# EasyEDA Pro project ProDoc_SMD test 2_2025-04-19.epro, board PCB1_3
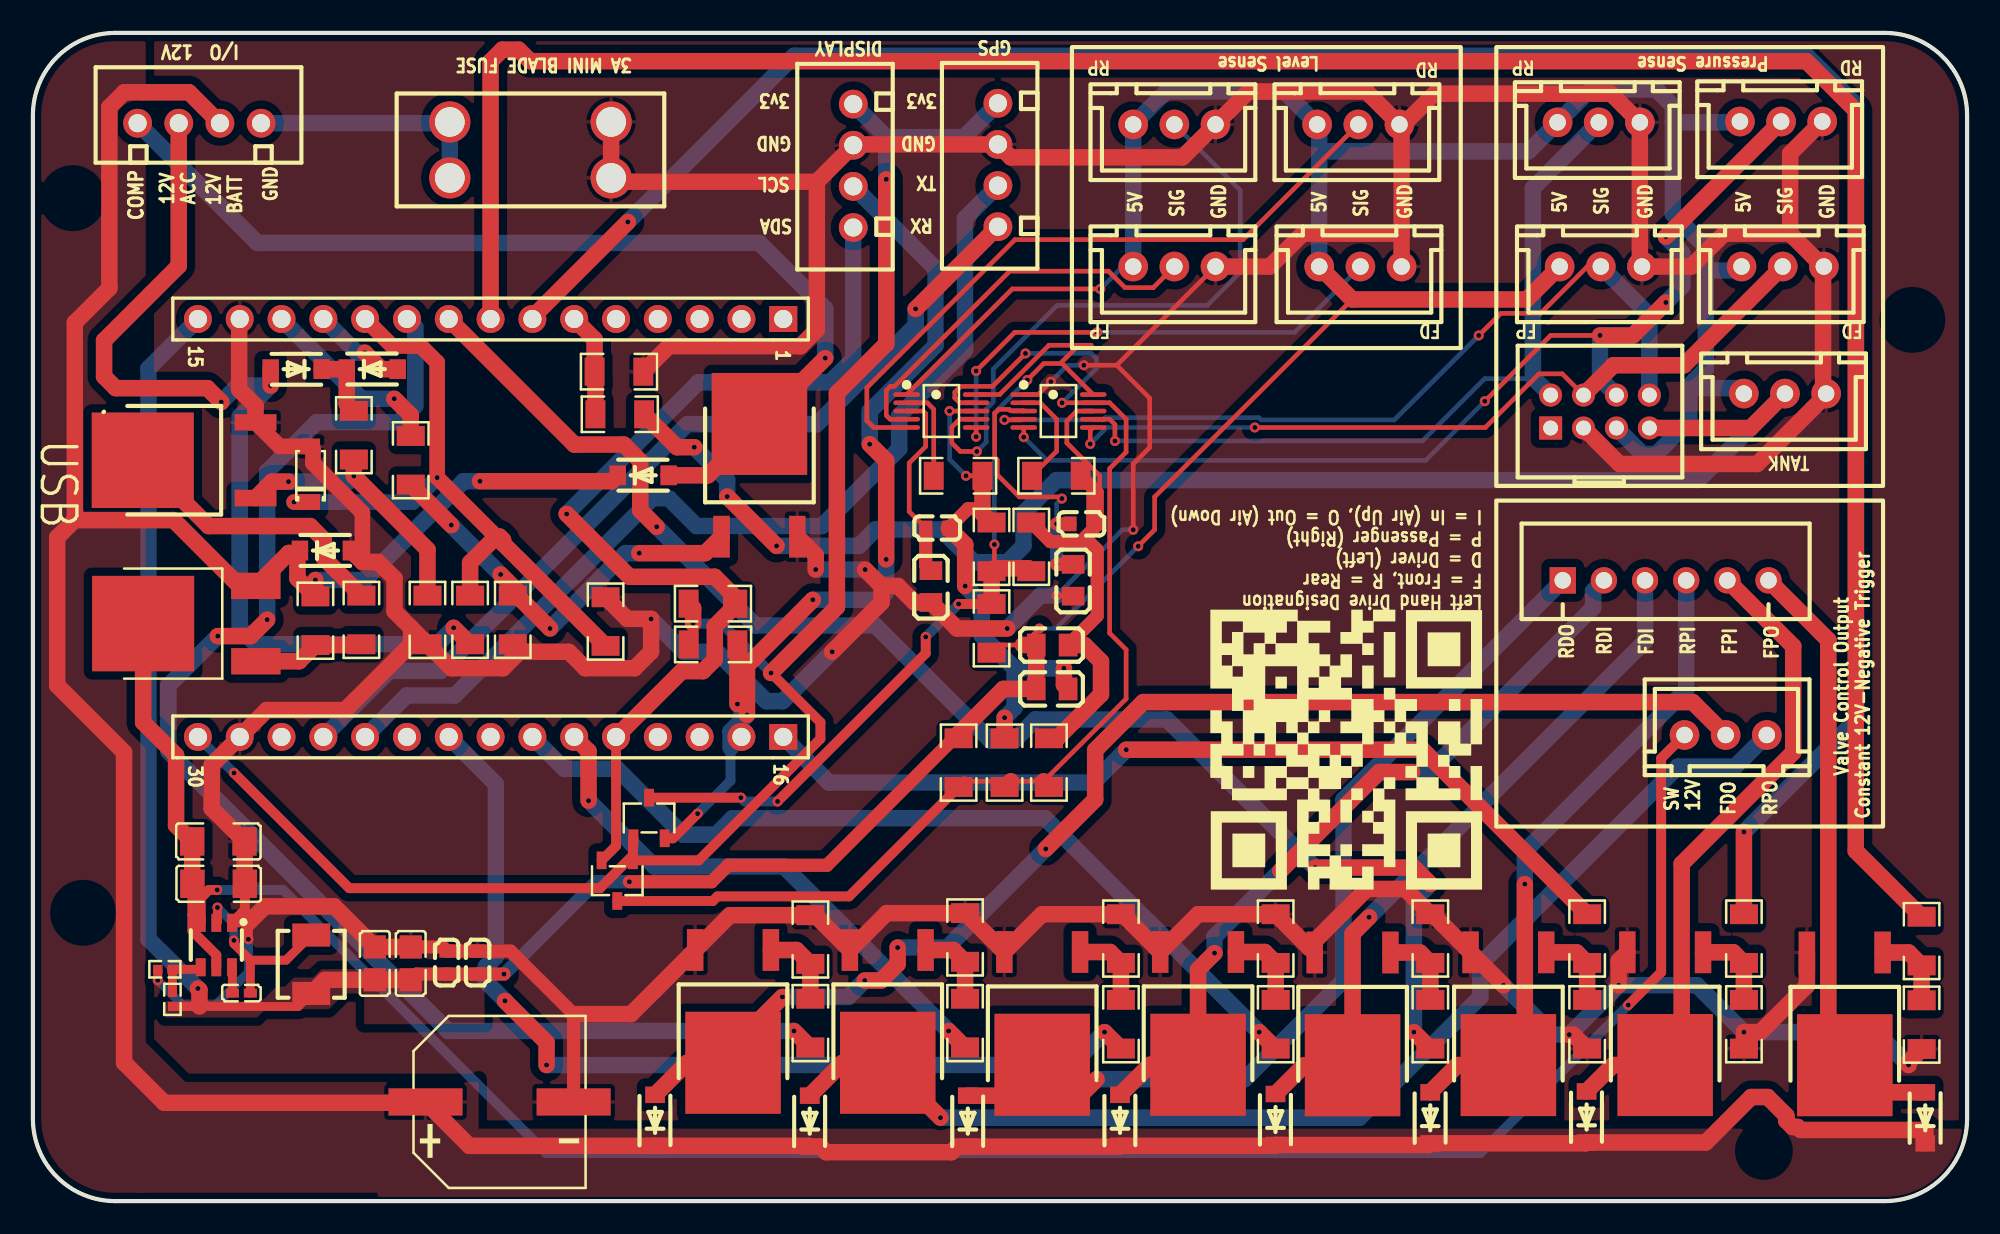
[diagram p1: board, top side]
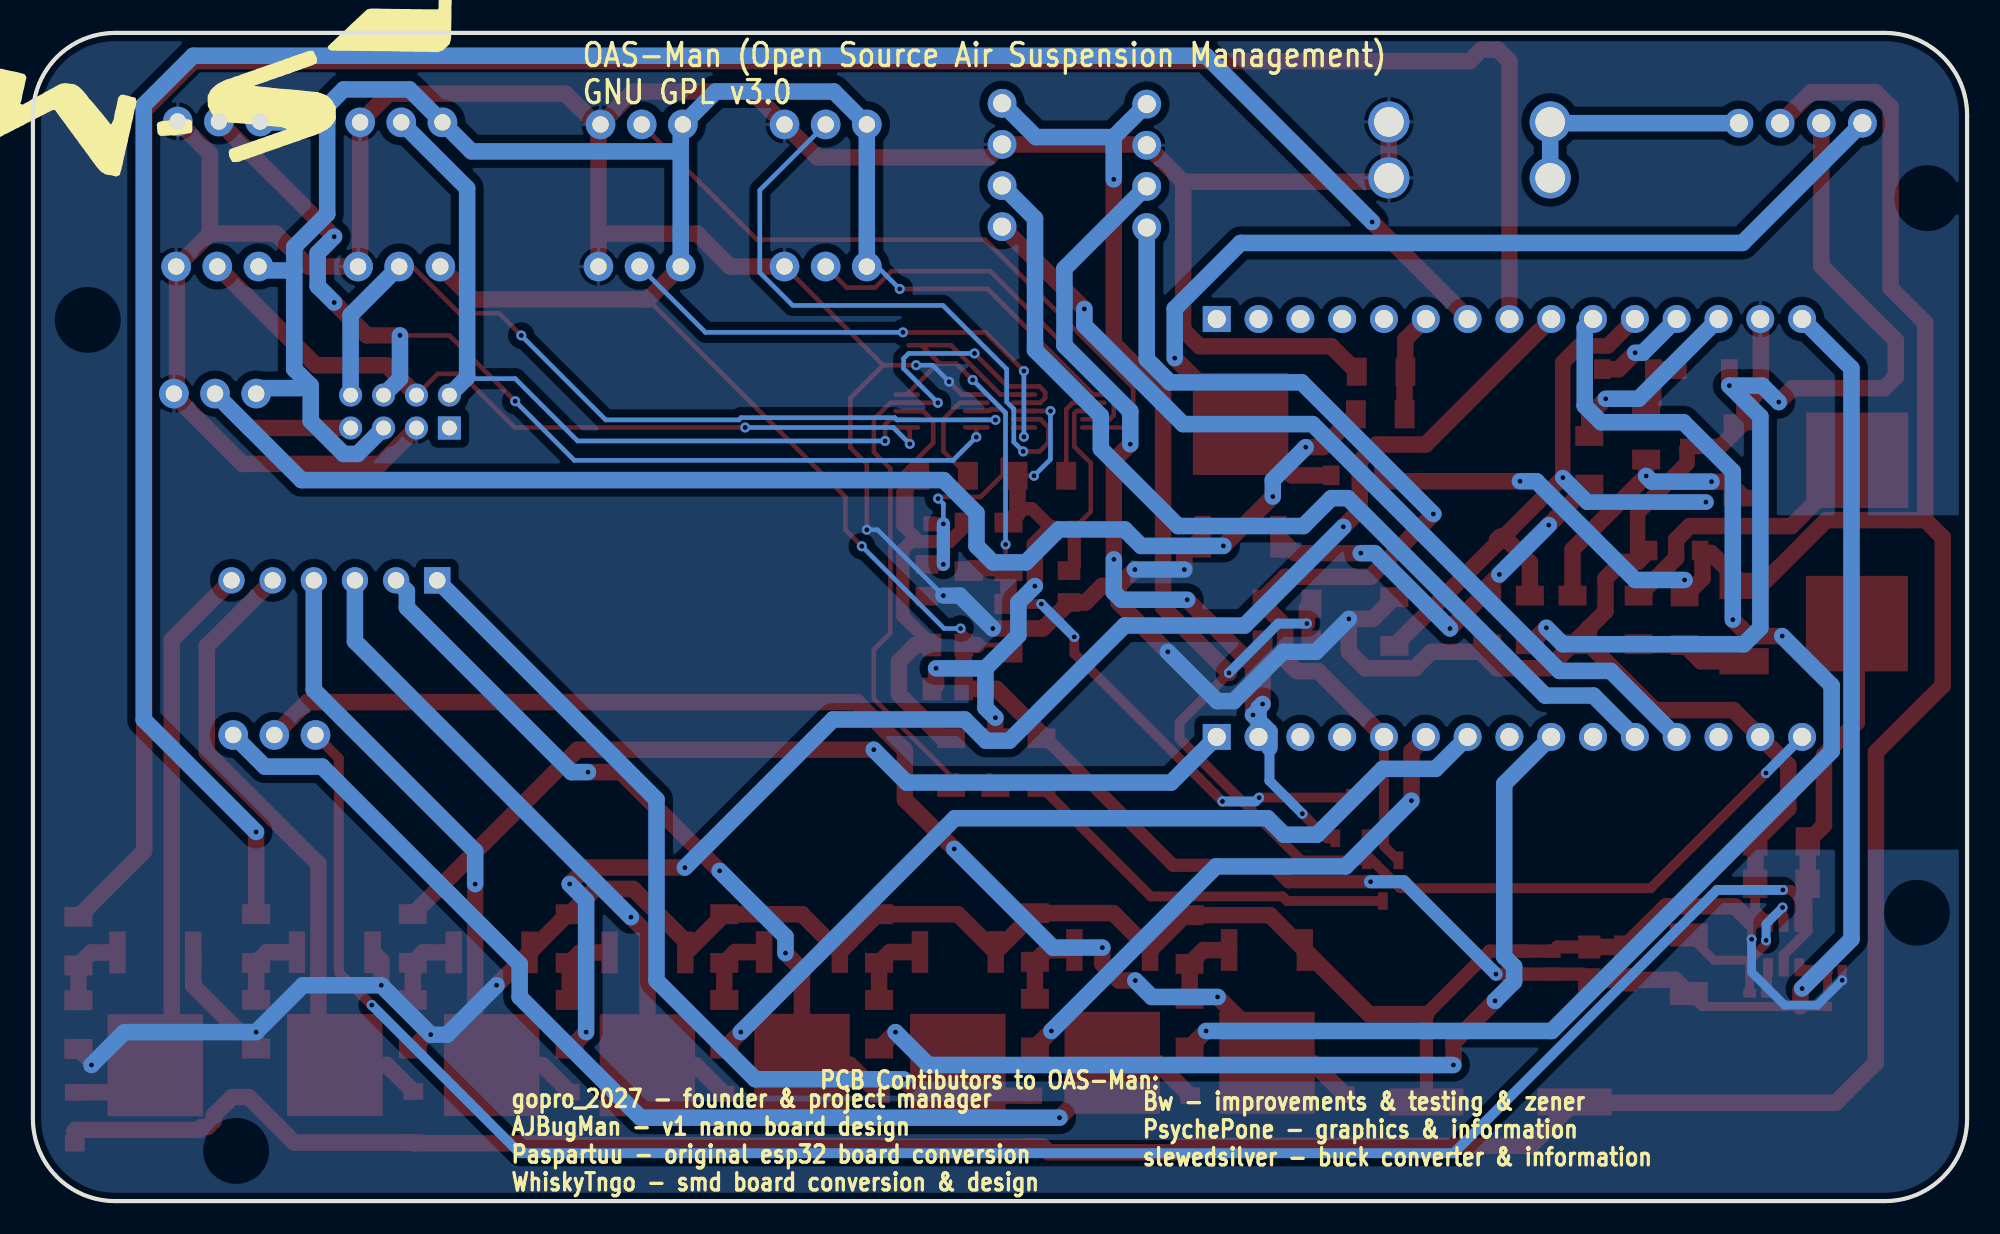
[diagram p2: board, bottom side, seen from below]

Outline 117.5 x 71 mm; copper layers: Top Layer, Bottom Layer. Coordinates in mm from the lower left corner of the outline.
Outline path: 0,66 0,5 arc(1.46,1.46) 5,0 112.5,0 arc(116.04,1.46) 117.5,5 117.5,66 arc(116.04,69.54) 112.5,71 5,71 arc(1.46,69.54) 0,66
Stack: Top Layer 0.035mm / Dielectric1 1.51mm FR4 er 4.5 / Bottom Layer 0.035mm

## Design rules (mm)
template: Custom Config
spacing copperThickness1oz: track to track 0.102, other pairs 0.152 to 0.3
spacing copperThickness2oz (default): track to track 0.203, other pairs 0.152 to 0.3
track width copperThickness1oz (default): min 0.127, default 1, max 2.54
track width copperThickness2oz: min 0.203, default 0.254, max 2.54
differential pair differentialPair (default): width min 0.127, default 0.254, max 2.54; gap min 0.152, default 0.152
via viaSize (default): diameter min 0.5, default 0.61, max 10; hole min 0.3, default 0.305, max 6.3
net $1N33547 uses Fullfill
pour e143 uses Fullfill
pour e746 uses Fullfill
pour e1012 uses Fullfill

## Placement (name value [footprint] x y rotation side)
C1  1uF  [C0603]  54.93 40.91 180 top
C2  1uF  [C0603]  63.7 41.16 180 top
C5  1uF  [C0603]  25.14 14.5 270 top
C6  1uF  [C0603]  27.02 14.5 270 top
C12  100nF  [C0402]  12.67 12.64 0 top
C13  22uF  [C0805]  22.95 14.44 270 top
C14  22uF  [C0805]  20.77 14.44 270 top
C15  10uF  [C1206]  11.27 21.86 180 top
C16  10uF  [C1206]  11.28 19.28 180 top
C17  1000uF  [CAP-SMD_BD10.0-L10.3-W10.3-FD]  28.35 6.03 0 top
CN1  XH-4A绿色  [CONN-TH_XH-4A-1]  10.11 65.51 180 top
D1  SM4007PL  [SOD-123F_L2.8-W1.8-LS3.7-RD]  94.39 5.11 90 top
D2  SM4007PL  [SOD-123F_L2.8-W1.8-LS3.7-RD]  114.96 5.06 90 top
D3  SM4007PL  [SOD-123F_L2.8-W1.8-LS3.7-RD]  75.49 4.96 90 top
D4  SM4007PL  [SOD-123F_L2.8-W1.8-LS3.7-RD]  37.8 4.91 90 top
D5  SM4007PL  [SOD-123F_L2.8-W1.8-LS3.7-RD]  56.79 4.86 90 top
D6  SM4007PL  [SOD-123F_L2.8-W1.8-LS3.7-RD]  66.04 4.91 90 top
D7  SM4007PL  [SOD-123F_L2.8-W1.8-LS3.7-RD]  47.19 4.86 90 top
D8  SM4007PL  [SOD-123F_L2.8-W1.8-LS3.7-RD]  84.89 5.06 90 top
D9  SM4007PL  [SOD-123F_L2.8-W1.8-LS3.7-RD]  37.07 44.11 0 top
D10  SM4007PL  [SOD-123F_L2.8-W1.8-LS3.7-RD]  17.77 39.54 0 top
D15  SM4007PL  [SOD-123F_L2.8-W1.8-LS3.7-RD]  15.99 50.56 180 top
D16  SM4007PL  [SOD-123F_L2.8-W1.8-LS3.7-RD]  20.61 50.56 0 top
F2  XF-508P-B-B  [FUSE-TH_4P-L16.0-W6.7]  30.23 63.89 0 top
FD_LEVEL2  XH-3A  [CONN-TH_XH-3A]  80.65 56.8 180 top
FD_PRESS1  XH-3A  [CONN-TH_XH-3A]  106.3 56.8 180 top
FP_LEVEL2  XH-3A  [CONN-TH_XH-3A]  69.34 56.8 180 top
FP_PRESS1  XH-3A  [CONN-TH_XH-3A]  95.25 56.8 180 top
GPS  XH-4A绿色  [CONN-TH_XH-4A-1]  58.62 62.97 270 top
L3  3.3uH  [IND-SMD_L4.5-W4.1_SL0420]  16.91 14.39 270 top
OLED1  XH-4A绿色  [CONN-TH_XH-4A-1]  49.84 62.92 270 top
Q1  MDT30N06L  [TO-252-2_L6.6-W5.6-P4.60-LS9.7-BR]  99.16 11.7 90 top
Q2  MDT30N06L  [TO-252-2_L6.6-W5.6-P4.60-LS9.7-BR]  110.07 11.68 90 top
Q3  MDT30N06L  [TO-252-2_L6.6-W5.6-P4.60-LS9.7-BR]  80.17 11.68 90 top
Q4  MDT30N06L  [TO-252-2_L6.6-W5.6-P4.60-LS9.7-BR]  42.53 11.83 90 top
Q5  MDT30N06L  [TO-252-2_L6.6-W5.6-P4.60-LS9.7-BR]  61.31 11.71 90 top
Q6  MDT30N06L  [TO-252-2_L6.6-W5.6-P4.60-LS9.7-BR]  70.78 11.71 90 top
Q7  MDT30N06L  [TO-252-2_L6.6-W5.6-P4.60-LS9.7-BR]  51.93 11.83 90 top
Q8  MDT30N06L  [TO-252-2_L6.6-W5.6-P4.60-LS9.7-BR]  89.63 11.69 90 top
Q9  MDT30N06L  [TO-252-2_L6.6-W5.6-P4.60-LS9.7-BR]  44.14 43.81 270 top
Q12  BSS138  [SOT-23-3_L2.9-W1.6-P1.90-LS2.8-BR]  35.5 19.47 90 top
Q13  BSS138  [SOT-23-3_L2.9-W1.6-P1.90-LS2.8-BR]  37.43 23.28 270 top
Q14  MDT30N06L  [TO-252-2_L6.6-W5.6-P4.60-LS9.7-BR]  10.1 45.03 0 top
Q15  MDT35P10D  [TO-252-2_L6.6-W6.1-P4.57-LS9.9-BR-CW]  10.12 35.1 0 top
R1  10kΩ  [R1206]  103.94 10.75 270 top
R2  10kΩ  [R1206]  114.74 10.72 270 top
R3  10kΩ  [R1206]  84.89 15.96 90 top
R4  10kΩ  [R1206]  47.23 15.9 90 top
R5  10kΩ  [R1206]  66.1 15.96 90 top
R6  10kΩ  [R1206]  75.5 15.96 90 top
R7  10kΩ  [R1206]  56.63 16.02 90 top
R8  10kΩ  [R1206]  94.42 10.75 270 top
R9  150Ω  [R1206]  103.94 15.96 90 top
R10  150Ω  [R1206]  114.74 15.8 90 top
R11  150Ω  [R1206]  84.89 10.75 270 top
R12  150Ω  [R1206]  47.23 10.82 270 top
R13  150Ω  [R1206]  66.1 10.75 270 top
R14  150Ω  [R1206]  75.5 10.75 270 top
R15  150Ω  [R1206]  56.63 10.82 270 top
R16  150Ω  [R1206]  94.42 15.96 90 top
R17  150Ω  [R1206]  22.95 45.03 90 top
R18  10kΩ  [R1206]  29.15 35.32 270 top
R19  1kΩ  [R1206]  35.65 47.82 0 top
R23  10kΩ  [R1206]  26.56 35.32 270 top
R24  2kΩ  [R1206]  35.6 50.41 180 top
R25  10kΩ  [R1206]  34.79 35.22 270 top
R27  10kΩ  [R1206]  56.24 26.65 270 top
R28  10kΩ  [R1206]  41.32 33.83 180 top
R29  10kΩ  [R1206]  58.24 34.81 270 top
R30  10kΩ  [R1206]  41.31 36.31 180 top
R33  1MΩ  [R1206]  58.24 39.76 270 top
R37  10kΩ  [R1206]  23.97 35.32 270 top
R38  150Ω  [R1206]  19.5 46.55 90 top
R39  10kΩ  [R1206]  17.16 35.27 270 top
R40  3kΩ  [R1206]  19.95 35.32 270 top
R41  1MΩ  [R1206]  56.2 44.08 180 top
R42  1MΩ  [R1206]  59.03 26.65 270 top
R43  1MΩ  [R1206]  62.17 44.08 180 top
R44  1MΩ  [R1206]  61.72 26.65 90 top
R45  1MΩ  [R1206]  60.65 39.76 90 top
R50  56.2kΩ  [R0402]  8.47 12.26 270 top
R51  10kΩ  [R0402]  8.02 14.09 0 top
RD_LEVEL2  XH-3A  [CONN-TH_XH-3A]  80.52 65.44 180 top
RD_PRESS1  XH-3A  [CONN-TH_XH-3A]  106.2 65.61 180 top
RP_LEVEL2  XH-3A  [CONN-TH_XH-3A]  69.34 65.44 180 top
RP_PRESS1  XH-3A  [CONN-TH_XH-3A]  95.12 65.56 180 top
TANK1  XH-3A  [CONN-TH_XH-3A]  106.44 49.08 180 top
U4  ADS1115IDGSR  [MSOP-10_L3.0-W3.0-P0.50-LS5.0-BL]  55.19 48.02 270 top
U5  ADS1115IDGSR  [MSOP-10_L3.0-W3.0-P0.50-LS5.0-BL]  62.3 48.02 270 top
U7  PM2.54-1*15  [HDR-TH_15P-P2.54-V-F]  27.8 53.61 180 top
U8  PM2.54-1*15  [HDR-TH_15P-P2.54-V-F]  27.8 28.21 180 top
U9  GZ2012D152TF  [L0805]  61.92 31.13 0 top
U10  GZ2012D152TF  [L0805]  54.55 37.35 90 top
U11  GZ2012D152TF  [L0805]  61.92 33.8 0 top
U12  GZ2012D152TF  [L0805]  63.19 37.73 90 top
U13  TPS563200DDCR  [SOT-23-6_L2.9-W1.6-P0.95-LS2.8-BR]  11.14 15.56 90 top
U14  PHB2.0-02-8PZZ  [CONN-TH_8P-P2.00_XUNPU_PHB2.0-02-8PZZ]  95.2 47.99 0 top
VTA1  XH-3A  [CONN-TH_XH-3A]  102.83 28.33 0 top
VTB1  XH-6A  [CONN-TH_6P-P2.50_XH-6A]  99.15 37.73 180 top
ZD1  MMSZ4684  [SOD-123_L2.8-W1.8-LS3.7-RD]  16.87 44.18 90 top

## Footprints (pads in the part's own frame, mm; a bottom-side part is the same pattern mirrored in y, then rotated)
C0402
  rect 0.79x0.54 smd: 1(-0.545,0) 2(0.545,0)
C0603
  rect 0.8x0.9 smd: 1(-0.7,0) 2(0.7,0)
C0805
  rect 1.41x1.35 smd: 1(-1,0) 2(1,0)
C1206
  rect 1.485x1.728 smd: 1(-1.593,0) 2(1.593,0)
CAP-SMD_BD10.0-L10.3-W10.3-FD
  rect 4.5x1.65 smd: 1(-4.5,0) 2(4.5,0)
CONN-TH_6P-P2.50_XH-6A
  rect 1.6x1.6 hole 1: 1(6.213,0)
  round 1.6 hole 1: 2(3.713,0) 3(1.214,0) 4(-1.286,0) 5(-3.787,0) 6(-6.287,0)
CONN-TH_8P-P2.00_XUNPU_PHB2.0-02-8PZZ
  rect 1.4x1.4 hole 0.9: 1(-3,-1)
  round 1.4 hole 0.9: 2(-3,1) 3(-1,-1) 4(-1,1) 5(1,-1) 6(1,1) 7(3,-1) 8(3,1)
CONN-TH_XH-3A
  round 1.8 hole 1: 1(-2.5,0) 2(0,0) 3(2.5,0)
CONN-TH_XH-4A-1
  round 1.75 hole 1.1: 1(-3.75,0) 2(-1.25,0) 3(1.25,0) 4(3.75,0)
FUSE-TH_4P-L16.0-W6.7
  round 2.5 hole 1.8: 1(-4.9,1.7) 2(4.9,1.7) 3(4.9,-1.7) 4(-4.9,-1.7)
HDR-TH_15P-P2.54-V-F
  rect 1.7x1.575 hole 1.1: 1(-17.78,0)
  round 1.7 hole 1.1: 2(-15.24,0) 3(-12.7,0) 4(-10.16,0) 5(-7.62,0) 6(-5.08,0) 7(-2.54,0) 8(0,0) 9(2.54,0) 10(5.08,0) 11(7.62,0) 12(10.16,0) 13(12.7,0) 14(15.24,0) 15(17.78,0)
IND-SMD_L4.5-W4.1_SL0420
  rect 1.4x2.3 smd: 1(-1.775,0) 2(1.775,0)
L0805
  rect 1.133x1.377 smd: 1(-0.966,0) 2(0.966,0)
MSOP-10_L3.0-W3.0-P0.50-LS5.0-BL
  oval 0.28x1.62 smd: 1(-1,-2.11) 2(-0.5,-2.11) 3(0,-2.11) 4(0.5,-2.11) 5(1,-2.11) 6(1,2.11) 7(0.5,2.11) 8(0,2.11) 9(-0.5,2.11) 10(-1,2.11)
R0402
  rect 0.566x0.54 smd: 1(-0.433,0) 2(0.433,0)
R1206
  rect 1.208x1.701 smd: 1(-1.479,0) 2(1.479,0)
SOD-123_L2.8-W1.8-LS3.7-RD
  rect 0.95x1.15 smd: 1(-1.692,0) 2(1.692,0)
SOD-123F_L2.8-W1.8-LS3.7-RD
  rect 1x1.2 smd: 1(-1.55,0) 2(1.55,0)
SOT-23-3_L2.9-W1.6-P1.90-LS2.8-BR
  rect 1.07x0.6 smd: 1(1.235,-0.95) 2(1.235,0.95) 3(-1.235,0)
SOT-23-6_L2.9-W1.6-P0.95-LS2.8-BR
  rect 1.1x0.6 smd: 1(1.35,-0.95) 2(1.35,0) 3(1.35,0.95) 4(-1.35,0.95) 5(-1.35,0) 6(-1.35,-0.95)
TO-252-2_L6.6-W5.6-P4.60-LS9.7-BR
  rect 2.54x1 smd: 1(3.426,-2.3) 3(3.426,2.3)
  rect 6.2x5.8 smd: 2(-3.426,0)
TO-252-2_L6.6-W6.1-P4.57-LS9.9-BR-CW
  rect 3x1.6 smd: 1(3.424,-2.29) 3(3.424,2.29)
  rect 6.2x5.8 smd: 2(-3.424,0)

## Nets
As in the schematic, except:
$1N4374: D2.2 Q2.2 VTB1.6
$1N4463: D1.2 Q1.2 VTB1.5
$1N4464: D8.2 Q8.2 VTB1.4
$1N4465: D3.2 Q3.2 VTB1.3
$1N4466: D6.2 Q6.2 VTB1.2
$1N4467: D5.2 Q5.2 VTB1.1

Pads without a net: U7 1 2 3 4 5; U8 3 4 8 10 13; U14 1

## Via types
v1: diameter 0.61, hole 0.305, Top Layer to Bottom Layer, 114 vias

## Routing (per net, layer and track width the routed paths; a pad name or vN(x,y) marks a point on that pad's centre or on a via; arc(x,y) is an arc through that point)
3.3V: length 106.7
  Top Layer w0.6: 39.84,33.83 40.11,34.1 v1(40.11,35.1) ; v1(12.22,26.02) 19.22,19.02 34.45,19.02 36.45,21.02 ; 36.45,21.02 36.45,22.02 Q13.1 ; 36.45,21.02 Q12.1 40.45,20.71 47.84,28.1 47.84,29.1 v1(44.84,32.1)
  Top Layer w1: v1(51.84,62.1) 51.84,52.1 48.84,49.1 48.84,36.1 v1(44.84,32.1) ; v1(40.11,35.1) 40.11,36.04 R30.2
  Bottom Layer w0.6: v1(12.22,26.02) U8.15 ; v1(44.84,32.1) 41.84,35.1 v1(40.11,35.1)
  Bottom Layer w1: GPS.1 56.57,64.67 51.84,64.67 ; v1(51.84,62.1) 51.84,64.67 ; 51.84,64.67 OLED1.1
12VACC: length 60.2
  Top Layer w1: v1(14.44,49.56) D15.2 ; R23.2 v1(25.56,34.84) ; v1(11.44,48.56) 10.6,49.41 5.03,49.41 4.32,50.12 4.32,52.31 8.86,56.84 CN1.3
  Bottom Layer w1: v1(25.56,34.84) 24.56,33.84 13.56,33.84 12.56,34.84 12.56,47.68 v1(14.44,49.56) 12.44,49.56 v1(11.44,48.56)
12VS: length 140.1
  Top Layer w0.6: VTA1.1 98.92,26.91 98.92,13.91 v1(96.92,11.91) ; U13.5 11.14,14.96 9.69,16.41 9.69,17.41 ; 9.69,17.41 U13.3 10.19,18.41 10.69,18.91 v1(11.19,18.91) ; 9.69,17.41 C16.2
  Top Layer w1: Q15.2 6.7,29.1 8.7,27.1 8.7,22.84 C15.2 9.68,19.3 C16.2
  Bottom Layer w0.6: v1(96.92,11.91) 87.92,2.91 31.19,2.91 15.19,18.91 v1(11.19,18.91)
+5V: length 263.8
  Top Layer w0.28: v1(67.15,39.8) 68.15,40.8 68.15,42.8 80.15,54.8 ; v1(61.15,34.8) 60.15,33.8 58.71,33.8 R29.2 ; U4.1 59.5,55.44 v1(64.84,55.44)
  Top Layer w0.54: R50.2 16.12,11.83 L3.2
  Top Layer w0.8: C13.2 23.3,13.8 C5.2 C6.2 v1(28.62,13.8) ; 56.24,28.41 48.24,20.41 42.24,20.41 41.24,19.41 v1(36.24,19.41)
  Top Layer w1: FD_LEVEL2.3 80.15,54.8 90.75,54.8 FP_PRESS1.3 ; v1(10.02,12.92) 10.12,12.83 10.12,11.83 ; L3.2 17.73,13.44 C14.2 C13.2 ; R27.1 56.24,28.41 58.95,31.13 60.95,31.13 60.95,33.8 60.15,33.8
  Bottom Layer w0.28: 66.84,57.44 v1(64.84,55.44) ; v1(67.15,39.8) 62.15,34.8 v1(61.15,34.8)
  Bottom Layer w0.8: v1(36.24,19.41) 34.24,19.41 v1(28.62,13.8)
  Bottom Layer w1: 100.62,49.41 100.62,49.56 101.62,50.56 101.62,56.56 ; 100.62,49.41 103.6,49.41 TANK1.3 ; 100.62,49.41 100.62,47.41 98.62,45.41 97.78,45.41 U14.5 ; 99.62,65.56 103.65,65.56 RD_PRESS1.3 ; 99.62,65.56 99.62,66.56 98.62,67.56 94.62,67.56 RP_PRESS1.3 90.86,63.8 78.15,63.8 ; 99.62,65.56 99.62,59.99 101.62,57.99 101.62,56.56 ; FD_PRESS1.3 103.56,56.56 101.62,56.56 ; U7.15 7.02,50.61 7.02,15.92 v1(10.02,12.92) ; 78.15,63.8 78.15,65.31 RD_LEVEL2.3 76.02,67.44 68.84,67.44 RP_LEVEL2.3 FP_LEVEL2.3 ; 78.15,63.8 FD_LEVEL2.3
GND: length 466.8
  Top Layer w0.28: 65.84,50.8 67.84,48.8 67.84,45.8 66.84,44.8 v1(66.84,40.8) ; 65.84,50.8 v1(63.84,50.8) ; 65.84,50.8 FP_LEVEL2.1 ; v1(62.19,36.8) 63.15,36.8 U12.1 ; U5.1 61.06,49.02 v1(61.84,49.8)
  Top Layer w0.54: U13.1 13.09,16.91 v1(13.09,15.91) ; v1(7.58,13.42) R51.1
  Top Layer w0.6: C16.1 12.87,17.7 U13.1
  Top Layer w0.8: C17.2 32.85,11.37 29.02,15.2 C6.1 C5.1 24.89,15.44 C13.1
  Top Layer w0.95: Q14.3 14.98,45.87 ZD1.2 17.02,45.72 17.02,44.84 20.02,41.84 20.02,38.84
  Top Layer w1: v1(93.33,10.12) 93.57,10.12 R8.2 ; 13.09,16.91 14.09,17.91 18.3,17.91 C14.1 C13.1 ; 106.75,58.8 108.75,56.8 ; 106.75,58.8 106.75,63.66 RD_PRESS1.1 ; 106.75,58.8 102.75,58.8 100.75,56.8 FP_PRESS1.1 97.62,56.93 RP_PRESS1.1 95.88,67.31 85.15,67.31 83.15,65.31 ; 108.75,56.8 108.75,48.8 ; 108.75,56.8 FD_PRESS1.1 ; Q2.3 107.77,13.1 104.94,10.27 v1(103.94,10.27) R1.2 ; 51.55,37.39 52.55,37.39 53.55,36.39 U10.1 56.14,34.8 v1(59.19,34.8) ; 51.55,37.39 51.55,36.39 v1(48.55,33.39) ; 51.55,37.39 v1(50.55,38.39) ; Q1.3 96.33,14.6 v1(96.33,13.12) ; 47.62,61.95 35.36,61.95 F2.3 F2.2 ; 47.62,61.95 47.62,52.95 46.62,51.95 38.62,51.95 R24.1 ; 47.62,61.95 49.89,64.22 ; 77.5,15.44 81.03,18.97 83.36,18.97 R3.2 85.02,17.44 Q8.3 v1(89.33,13.12) ; 77.5,15.44 77.87,15.11 ; 77.5,15.44 R6.2 70.78,17.44 Q6.3 66.19,17.44 R5.2 61.31,17.44 Q5.3 56.65,17.5 R7.2 51.87,17.5 Q7.3 47.51,17.38 R4.2 42.35,17.38 Q4.3 36.34,11.37 32.85,11.37 ; 29.55,33.39 R18.2 ; 29.55,33.39 32.55,33.39 33.55,32.39 36.55,32.39 37.55,33.39 v1(37.55,35.39) 36.1,35.39 R25.1 ; 29.55,33.39 28.55,32.39 25.43,32.39 R37.2 22.97,34.84 ; Q14.3 13.53,48.33 12.53,49.33 12.53,53.57 U7.14 ; 49.89,64.22 GPS.2 59.41,63.44 69.84,63.44 RP_LEVEL2.1 73.84,67.44 81.02,67.44 RD_LEVEL2.1 83.15,65.31 ; 49.89,64.22 49.89,64.22 OLED1.2 ; v1(113.94,8.27) 113.94,8.45 R2.2 ; 83.15,58.8 83.15,65.31 ; 83.15,58.8 FD_LEVEL2.1 ; 83.15,58.8 77.15,58.8 75.15,56.8 FP_LEVEL2.1 ; 22.97,34.84 21.97,35.84 21.97,37.84 20.97,38.84 20.02,38.84 D10.2 ; 22.97,34.84 22.97,33.84 18.97,29.84 14.2,29.84 U8.14 10.86,26.51 10.86,23.86 C15.1 12.86,19.3 C16.1 ; 108.75,48.8 104.75,44.8 96.39,44.8 U14.3 ; 108.75,48.8 TANK1.1 ; v1(47.55,38.39) 47.55,39.26 Q9.3
  Bottom Layer w0.28: v1(66.84,40.8) 66.19,40.8 v1(62.19,36.8) ; v1(63.84,50.8) 62.84,50.8 v1(61.84,49.8)
  Bottom Layer w0.54: v1(13.09,15.91) 13.09,13.91 11.09,11.91 9.09,11.91 v1(7.58,13.42)
  Bottom Layer w1: v1(59.19,34.8) 61.19,36.8 v1(62.19,36.8) ; v1(48.55,33.39) 45.55,30.39 44.55,30.39 41.55,33.39 39.55,33.39 v1(37.55,35.39) ; v1(89.33,13.12) 92.33,10.12 v1(93.33,10.12) v1(96.33,13.12) 101.09,13.12 v1(103.94,10.27) 111.94,10.27 v1(113.94,8.27) ; v1(50.55,38.39) v1(47.55,38.39)
VCC: length 225.2
  Top Layer w1: 2.53,41.39 8.54,41.39 12.54,37.39 Q15.3 15.54,39.39 16.07,39.39 ; 2.53,41.39 1.48,40.34 1.48,31.34 5.54,27.28 5.54,8.41 7.98,5.98 23.8,5.98 C17.1 26.51,3.36 47.14,3.36 D7.1 47.85,3.31 48.19,2.97 55.79,2.97 56.13,3.31 D5.1 65.99,3.31 66.04,3.36 75.44,3.36 D3.1 84.78,3.41 D8.1 94.34,3.51 D1.1 101.62,3.56 104.39,6.32 105.39,6.32 106.52,5.19 106.52,4.89 106.9,4.5 107.21,4.5 107.39,4.32 114.91,4.32 114.96,4.27 D2.1 ; 2.53,41.39 2.54,41.41 2.54,53.39 4.65,55.49 4.65,66.49 5.54,67.39 9.48,67.39 CN1.2 ; D9.1 35.16,43.75 v1(27.16,43.75) ; 16.07,39.39 16.07,37.84 R39.1 v1(17.16,37.75) ; 16.07,39.39 D10.1
  Bottom Layer w1: v1(27.16,43.75) 26.16,43.75 20.16,37.75 v1(17.16,37.75)
D13: length 11.5
  Top Layer w1: 22.95,46.5 22.95,47.76 v1(21.95,48.76)
  Bottom Layer w1: v1(21.95,48.76) 19.95,48.76 U7.13
D14: length 42.2
  Top Layer w0.95: v1(15.87,42.48) ZD1.1 ; 28.56,39.97 v1(24.56,43.97) 24.56,50.97 23.56,51.97 21.82,51.97 U7.11
  Top Layer w1: R23.1 26.56,38.8 28.14,40.39 28.35,40.39 28.56,40.18 28.56,39.97 R25.2
  Bottom Layer w0.95: v1(15.87,42.48) 23.07,42.48 v1(24.56,43.97)
ESPD12: length 5.8
  Top Layer w1: D16.2 21.17,50.56 v1(20.17,51.56)
  Bottom Layer w1: v1(20.17,51.56) 19.69,51.56 U7.12
RX: length 54.4
  Top Layer w1: GPS.4 v1(53.62,54.22)
  Bottom Layer w1: U8.12 21.66,32.22 24.76,32.22 39.76,47.22 47.62,47.22 53.62,53.22 v1(53.62,54.22)
SCL: length 58.6
  Top Layer w0.6: Q13.2 38.88,22.05 v1(40.38,23.55)
  Top Layer w1: v1(47.38,36.55) 43.38,32.55 v1(43.38,29.55) ; v1(51.84,39) 51.84,45 v1(50.84,46) ; v1(42.8,30.21) R28.1
  Bottom Layer w0.6: U8.2 42.38,27.55 42.38,25.55 v1(40.38,23.55)
  Bottom Layer w1: v1(50.84,46) 50.84,48 54.84,52 54.84,56.67 OLED1.3 ; v1(51.84,39) 51.84,37 51.38,36.55 v1(47.38,36.55) ; 42.38,27.55 42.38,28.55 43.04,29.21 ; v1(42.8,30.21) 43.04,29.97 43.04,29.21 ; 43.04,29.21 v1(43.38,29.55) ; 43.04,29.21 U8.2
SDA: length 62.1
  Top Layer w0.6: Q12.2 35.42,21.58 U8.5
  Top Layer w1: 42.42,35.94 42.42,36.94 41.42,37.94 36.24,37.94 v1(32.42,41.76) ; 42.42,35.94 41.42,34.94 41.42,32.92 40.71,32.21 39.42,32.21 U8.5 ; 42.42,35.94 R30.1
  Bottom Layer w1: OLED1.4 49.84,51.17 48.42,49.76 40.42,49.76 v1(32.42,41.76)
TANKPRESSUESIG: length 89
  Top Layer w1: v1(40.18,45.82) 39.13,45.82 R19.2 ; U14.7 104.34,46.99 TANK1.2 ; v1(45.18,39.82) v1(42.18,42.82)
  Bottom Layer w1: v1(40.18,45.82) 42.18,43.82 v1(42.18,42.82) ; TANK1.2 101.18,43.82 62.18,43.82 60.18,41.82 60.18,39.82 59.18,38.82 57.18,38.82 55.18,40.82 51.18,40.82 50.18,39.82 v1(45.18,39.82)
TX: length 59.6
  Bottom Layer w1: U8.11 22.69,30.72 25.62,30.72 37.62,42.72 38.62,42.72 40.32,41.03 47.93,41.03 52.62,45.72 52.62,47.72 56.62,51.72 56.62,59.72 GPS.3
$1N4350: length 5
  Top Layer w1: R8.1 R16.1 93.78,15.12 Q8.1
$1N4351: length 4.9
  Top Layer w1: R15.1 R7.1 55.91,15.26 Q7.1
$1N4352: length 4.9
  Top Layer w1: R14.1 R6.1 74.83,15.14 Q6.1
$1N4353: length 5
  Top Layer w1: R13.1 R5.1 65.44,15.14 Q5.1
$1N4354: length 4.9
  Top Layer w1: Q4.1 46.39,15.26 47.23,14.42 R12.1
$1N4355: length 4.9
  Top Layer w1: R11.1 R3.1 84.26,15.11 82.47,15.11
$1N4356: length 4.8
  Top Layer w1: R2.1 R10.1 113.95,15.11 Q2.1
$1N4357: length 5
  Top Layer w1: Q1.1 103.3,15.12 R9.1 R1.1
$1N4371: length 78.7
  Top Layer w1: v1(45.53,12.41) 42.53,9.41 Q4.2 39.74,8.41 37.8,6.46 ; v1(61.53,21.41) 64.53,24.41 64.53,27.41 67.45,30.33 100.83,30.33 102.83,28.33 ; v1(50.53,13.41) 51.53,13.41 52.53,14.41 v1(52.53,15.41)
  Bottom Layer w1: v1(61.53,21.41) 55.53,15.41 v1(52.53,15.41) ; v1(45.53,12.41) 49.53,12.41 v1(50.53,13.41)
$1N4374: length 37
  Top Layer w1: D2.2 111.71,6.61 Q2.2 109.07,9.26 109.07,34.09 VTB1.6
$1N4376: length 25.2
  Top Layer w1: Q9.1 40.84,39.38 v1(36.84,39.38) ; v1(28.41,38.09) 29.41,37.09 29.41,36.8 ; v1(25.41,41.09) R17.1 ; v1(31.41,34.8) 29.41,36.8 ; 29.41,36.8 R18.1
  Bottom Layer w1: v1(28.41,38.09) v1(25.41,41.09) ; v1(31.41,34.8) 35.99,39.38 v1(36.84,39.38)
$1N4377: length 151.1
  Top Layer w1: R10.2 110.74,21.28 110.74,66.28 107.74,69.28 30.21,69.28 29.51,69.98 28.51,69.98 27.8,69.27 U7.8
$1N4378: length 87.5
  Top Layer w1: R11.2 v1(83.89,10.27) ; v1(37.89,40.98) 36.89,41.98 36.89,44.98 35.89,45.98 32.89,45.98 U7.9 ; v1(84.89,19.27) 83.89,20.27 v1(77.89,20.27)
  Bottom Layer w1: v1(37.89,40.98) 43.89,34.98 51.18,34.98 58.19,27.98 59.6,27.98 60.89,29.27 68.89,29.27 v1(77.89,20.27) ; v1(84.89,19.27) 83.89,18.27 v1(83.89,10.27)
$1N4379: length 61.9
  Top Layer w1: v1(48.14,51.23) Q9.2 41.01,44.11 D9.2
  Bottom Layer w1: CN1.4 13.64,58.23 44.14,58.23 48.14,54.23 v1(48.14,51.23)
$1N4380: length 59
  Top Layer w1: R13.2 v1(65.1,10.27) ; v1(31.2,8.27) 31.2,9.64 v1(28.68,12.17)
  Bottom Layer w1: v1(31.2,8.27) 63.1,8.27 v1(65.1,10.27) ; U8.9 28.12,25.36 28.12,14.85 27.52,14.25 27.52,13.34 28.68,12.18 v1(28.68,12.17)
$1N4381: length 53.8
  Top Layer w1: R14.2 v1(74.5,10.27)
  Bottom Layer w1: v1(74.5,10.27) 61.5,23.27 42.5,23.27 41.5,22.27 39.5,22.27 35.5,26.27 32.28,26.27 U8.7
$1N4383: length 6.3
  Top Layer w1: 34.17,47.82 34.17,50.36 R24.2 34.12,52.37 U7.6
$1N4402: length 35.9
  Top Layer w0.28: 64.81,41.08 64.81,44.08 62.81,46.08 62.81,47.42 63.41,48.02 U5.8
  Top Layer w0.8: 63.65,40.08 61.81,40.08 R45.2 ; 63.65,40.08 64.15,40.08 64.65,39.58 64.65,35.56 U11.2 ; 63.65,40.08 64.65,41.08 64.65,43.08 64.4,43.34 ; 64.4,43.34 C2.1 ; 64.4,43.34 R43.1
  Top Layer w1: U11.2 63.89,33.8 64.89,32.8 64.89,30.8 62.22,28.13 R44.2
$1N4403: length 30.5
  Top Layer w0.28: v1(64.65,52.8) 59.65,52.8 v1(57.3,50.45) ; v1(57.3,46.45) U4.6
  Bottom Layer w0.28: FD_LEVEL2.2 76.65,52.8 v1(64.65,52.8) ; v1(57.3,50.45) v1(57.3,46.45)
$1N4407: length 24.3
  Top Layer w0.28: U4.4 52.08,47.52 51.84,47.76 51.84,49.27 52.09,49.52 52.34,49.52 59.34,56.52 65.34,56.52 66.34,55.52 68.06,55.52 FP_LEVEL2.2
$1N4413: length 41.1
  Top Layer w0.28: U4.5 51.08,47.02 50.66,47.44 50.66,49.44 59.66,58.44 73.52,58.44 RD_LEVEL2.2
$1N4416: length 62.9
  Top Layer w0.28: v1(60.19,46.43) U5.5 ; v1(88.2,48.61) 92.2,52.61 v1(95.2,52.61)
  Top Layer w1: v1(99.2,54.61) 97.2,52.61 v1(95.2,52.61) ; RD_PRESS1.2 v1(99.2,58.61)
  Bottom Layer w0.28: v1(60.19,46.43) 61.6,45.02 84.6,45.02 v1(88.2,48.61)
  Bottom Layer w1: v1(99.2,58.61) 100.2,57.61 100.2,55.61 v1(99.2,54.61) ; U14.6 95.2,49.99 v1(95.2,52.61)
$1N4419: length 31.6
  Top Layer w0.28: v1(56.68,44.08) R41.1 ; U4.8 v1(55.68,48.02)
  Top Layer w0.8: C1.1 56.81,42.08 57.68,42.08
  Top Layer w1: C1.1 56.63,39.91 v1(56.63,37.38) ; R41.1 57.68,41.8 R33.1 ; v1(62.63,32.38) 62.63,31.38 U9.2 ; v1(59.03,29.38) R42.1
  Bottom Layer w0.28: v1(55.68,48.02) 55.68,45.08 v1(56.68,44.08)
  Bottom Layer w1: 59.63,32.38 59.63,29.98 v1(59.03,29.38) ; 59.63,32.38 57.63,34.38 57.63,36.38 v1(56.63,37.38) ; 59.63,32.38 v1(62.63,32.38)
$1N4423: length 37.9
  Top Layer w0.28: v1(57.34,45.56) 56.34,45.56 55.82,46.08 55.82,47.04 56.3,47.52 U4.7
  Bottom Layer w0.28: v1(57.34,45.56) 57.91,46.13 57.91,48.14 58.34,48.57 58.34,50.56 62.22,54.44 71.34,54.44 73.34,56.44 73.34,61.44 RP_LEVEL2.2
$1N4424: length 48.7
  Top Layer w0.28: v1(74.23,47.02) 88.23,47.02 91.49,50.28 92.91,50.28 U14.4 ; U5.6 64.23,46.84 v1(64.23,46.02)
  Top Layer w1: FD_PRESS1.2 100.3,50.8 96.01,50.8 U14.4
  Bottom Layer w0.28: v1(74.23,47.02) 65.23,47.02 v1(64.23,46.02)
$1N4428: length 48.2
  Top Layer w0.28: U5.7 65.41,47.52 65.73,47.2 v1(65.73,46.2)
  Bottom Layer w0.28: v1(65.73,46.2) 84.41,46.2 88.2,49.99 91.2,49.99
  Bottom Layer w1: RP_PRESS1.2 91.12,61.56 91.12,50.06 91.2,49.99 U14.2
$1N4436: length 55
  Top Layer w1: R16.2 84.42,27.44 v1(66.42,27.44)
  Bottom Layer w1: U8.1 48.36,25.44 64.42,25.44 v1(66.42,27.44)
$1N4438: length 140.4
  Top Layer w1: R9.2 v1(103.94,22.44) ; v1(36.14,59.51) 30.34,53.71 U7.7
  Bottom Layer w1: v1(103.94,22.44) 110.77,29.26 110.77,66.61 107.77,69.61 46.24,69.61 v1(36.14,59.51)
$1N4442: length 33.3
  Top Layer w1: v1(33.76,24.34) 33.76,27.34 U8.6 ; 56.63,9.34 v1(55.63,10.34)
  Bottom Layer w1: v1(55.63,10.34) 45.63,20.34 37.76,20.34 v1(33.76,24.34)
$1N4443: length 50.4
  Top Layer w0.28: FP_PRESS1.2 94.44,56.8 91.59,53.96 89.18,53.96 v1(87.83,52.61) ; v1(59.02,47.48) 59.97,47.48 59.99,47.5 60.17,47.5 U5.4
  Bottom Layer w0.28: v1(59.02,47.48) 65.01,47.48 65.15,47.62 74.48,47.62 74.62,47.48 82.7,47.48 v1(87.83,52.61)
  Bottom Layer w1: U14.8 98.2,53.85 FP_PRESS1.2
$1N4453: length 74.1
  Top Layer w0.28: 56.58,25.52 61.41,25.52 66.41,30.52 66.41,33.52 65.41,34.52 65.41,44.52 66.41,45.52 66.41,47.52 65.41,48.52 U5.9 v1(62.52,48.52) ; v1(60.3,51.52) 58.3,49.52 56.36,49.52 56.01,49.17 56.01,48.81 56.3,48.52 U4.9
  Top Layer w0.6: 56.58,25.52 49.58,18.52 41.58,18.52 41.3,18.24 Q12.3
  Top Layer w1: 61.41,25.52 R44.1 ; 59.41,25.52 R42.2
  Bottom Layer w0.28: v1(60.3,51.52) 64.3,51.52 64.6,51.21 64.6,50.6 v1(62.52,48.52)
$1N4460: length 83.3
  Top Layer w1: v1(14.23,35.34) 13.23,34.34 v1(11.23,34.34) ; 47.23,9.34 v1(46.23,10.34)
  Bottom Layer w1: v1(14.23,35.34) 14.23,44.34 17.23,47.34 22.23,47.34 23.23,48.34 23.23,53.1 U7.10 ; v1(11.23,34.34) 8.23,31.34 8.23,27.34 25.23,10.34 v1(46.23,10.34)
$1N4463: length 39.8
  Top Layer w1: D1.2 95.99,8.27 Q1.2 100.16,9.27 100.16,20.49 106.94,27.27 106.94,33.73 VTB1.5
$1N4464: length 39.4
  Top Layer w1: v1(90.63,19.27) 90.63,9.27 Q8.2 86.54,8.27 D8.2
  Bottom Layer w1: VTB1.4 100.44,31.07 90.63,21.27 v1(90.63,19.27)
$1N4465: length 42.2
  Top Layer w1: D3.2 77.24,8.26 Q3.2 80.17,16.26 v1(81.17,17.26)
  Bottom Layer w1: v1(81.17,17.26) 97.94,34.02 VTB1.3
$1N4466: length 46.9
  Top Layer w1: v1(83.78,26.07) 81.78,26.07 v1(75.78,20.07) ; 66.04,6.46 67.87,8.29 Q6.2 70.78,14.07 v1(71.78,15.07)
  Bottom Layer w1: v1(75.78,20.07) 71.78,16.07 v1(71.78,15.07) ; v1(83.78,26.07) 84.78,26.07 94.78,36.07 94.78,37.07 VTB1.2
$1N4467: length 58.2
  Top Layer w1: v1(64.62,7.41) 63.62,6.41 59.44,6.41 ; Q5.2 59.44,6.41 ; 59.44,6.41 D5.2
  Bottom Layer w1: VTB1.1 79.62,24.41 79.62,13.41 73.62,7.41 v1(64.62,7.41)
$1N4475: length 17.3
  Top Layer w1: Q14.2 10.67,41.03 16.85,41.03 17.67,40.2 17.67,39.08 R40.1
$1N4476: length 6.8
  Top Layer w1: R40.2 19.9,33.79 R39.2 16.18,32.81 Q15.1
$1N4478: length 16.6
  Top Layer w1: R38.1 v1(19.5,44.07) 23.97,39.6 R37.1 ; Q14.1 14.53,43.73 v1(15.53,43.73)
  Bottom Layer w1: v1(19.5,44.07) 19.15,43.73 v1(15.53,43.73)
$1N4481: length 71.2
  Top Layer w1: D7.2 49.19,8.41 Q7.2 51.93,8.27 v1(55.13,5.07)
  Bottom Layer w1: v1(55.13,5.07) 80.59,5.07 87.93,12.41 87.93,14.41 99.93,26.41 103.41,26.41 VTA1.3
$1N12707: length 11.7
  Top Layer w0.28: C1.2 53.23,41.91 53.23,44.86 54.23,45.86 54.23,47.86 54.08,48.02 U4.3
  Top Layer w0.8: 54.55,38.32 54.23,38.64 C1.2
$1N12784: length 5.9
  Top Layer w0.28: R41.2 54.73,48.13 54.33,48.52 U4.2
$1N13030: length 16.2
  Top Layer w0.28: v1(62.51,42.7) 62.41,42.8 59.93,42.8 58.58,44.15 58.58,45.05 58.43,45.21 58.43,47.87 58.68,48.12 59.31,48.12 59.39,48.04 60.17,48.04 U5.3
  Top Layer w0.8: C2.2 v1(62.19,41.16) ; v1(62.19,38.7) U12.2
  Bottom Layer w0.28: v1(62.51,42.7) 62.19,42.38 v1(62.19,41.16)
  Bottom Layer w0.8: v1(62.19,41.16) v1(62.19,38.7)
$1N13089: length 6.5
  Top Layer w0.28: U5.2 61.19,48.52 62.19,47.52 62.19,45.58 R43.2
$1N19403: length 58.3
  Top Layer w0.28: 63.52,52.02 62.41,50.91 ; 63.52,52.02 61.72,52.02 58.72,49.02 U4.10 ; 63.52,52.02 64.3,52.02 ; 62.41,50.91 61.41,50.91 v1(60.41,49.91) ; 62.41,50.91 62.52,50.91 U5.10 ; v1(58.41,39.91) 58.41,38.46 58.24,38.29
  Top Layer w0.6: R29.1 v1(56.24,36.29) ; v1(54.24,34.29) 54.24,33.29 v1(45.24,24.29) ; v1(43.01,24.52) Q13.3
  Top Layer w1: 58.24,38.29 R29.1 ; 58.41,38.46 60.48,38.46 60.65,38.29
  Bottom Layer w0.28: v1(58.41,39.91) 58.41,47.91 v1(60.41,49.91)
  Bottom Layer w0.6: v1(45.24,24.29) 43.24,24.29 v1(43.01,24.52) ; v1(56.24,36.29) v1(54.24,34.29)
$1N23795: length 4.2
  Top Layer w1: D15.1 19.07,50.56 19.07,48.46 19.5,48.03
$1N33541: length 1.6
  Top Layer w0.54: U13.6 12.12,14.18 C12.1
$1N33542: length 11.3
  Top Layer w0.54: 16.91,16.17 15.38,14.64 13.21,14.64 ; v1(11.21,17.84) 11.21,16.98 U13.2 ; C12.2 13.21,14.64 ; 13.21,14.64 12.21,15.64 v1(12.21,15.84)
  Bottom Layer w0.54: v1(12.21,15.84) 12.21,16.84 v1(11.21,17.84)
$1N33547: length 3.2
  Top Layer w0.54: U13.4 10.07,14.09 R51.2 8.47,14.06 8.47,12.69
$1N77029: length 14.9
  Bottom Layer w1: CN1.1 25.25,65.51 F2.1 F2.4

## Copper pours and planes (outline as drawn; the poured copper is in the pictures)
12VS on Bottom Layer: 0.76,41.18 13.54,41.18 13.54,21.86 0.76,21.86
+5V on Top Layer: 20.77,12.62 18.94,12.62 17.98,11.67 14.12,11.67 13.61,11.16 8.03,11.16 8.03,12.26 14.01,12.26 14.78,13.04 15.3,13.04 15.86,13.59 17.01,13.59 17.53,14.1 20.77,14.1
+5V on Top Layer: 20.12,14.15 27.43,14.15 27.43,10.75 20.12,10.75
GND on Top Layer: 4.28,65.51 49.94,65.51 49.94,49.97 4.28,49.97
GND on Top Layer: -1.22,73.13 118.47,73.13 118.47,-1.14 -1.22,-1.14
GND on Bottom Layer: -0.91,73.44 119.58,73.44 119.58,-0.58 -0.91,-0.58
VCC on Top Layer: 6.3,10.21 9.26,7.25 26.92,7.25 27.08,7.4 27.08,-0.59 26.43,-1.24 6.25,-1.24 6.3,-1.19
VCC on Top Layer: 20.93,4.4 118.47,4.4 118.47,-0.88 20.93,-0.88
VCC on Top Layer: -0.71,71.81 6.86,71.81 6.86,-2.3 -0.71,-2.3

## Text on the board
Bottom Silkscreen Layer: Bw - improvements & testing & zener / PsychePone - graphics & information / slewedsilver - buck converter & information | PCB Contibutors to OAS-Man: | gopro_2027 - founder & project manager / AJBugMan - v1 nano board design / Paspartuu - original esp32 board conversion / WhiskyTngo - smd board conversion & design | OAS-Man (Open Source Air Suspension Management) / GNU GPL v3.0 | PCB Design Contibutors to OAS-Man: / Paspartuu - esp32 board design / AJBugMan - nano board design / gopro_2027 - nano & esp32 board design / WhiskyTngo - SMD Board Conversion / Bw - Improvements / PsychePone - information / slewedsilver - information
Top Silkscreen Layer: Left Hand Drive Designation / F = Front, R = Rear / D = Driver (Left) / P = Passenger (Right) / I = In (Air Up), O = Out (Air Down) | RP | FP | RD | FD | TANK | GND | 5V | SIG | Valve Control Output / Constant 12V-Negative Trigger | 3A MINI BLADE FUSE | RX | TX | GPS | Level Sense | Pressure Sense | 12V / ACC | 12V / BATT | I/O  12V | 15 | 30 | 16 | 1 | RDO | RDI | FDI | RPI | SW / 12V | FDO | FPI | RPO | FPO | 3v3 | SCL | SDA | DISPLAY | COMP | USB
